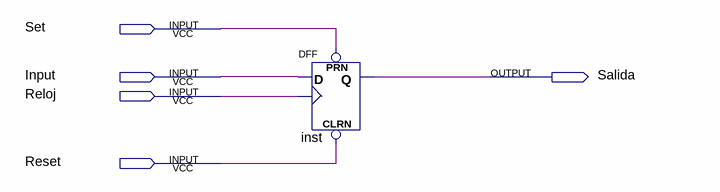
[diagram p0: schematic sheet]
// Quartus schematic FlipFlopD.bdf as structural Verilog: 1 symbols, 5 pins
module FlipFlopD (
  input  Set,
  input  Input,
  input  Reloj,
  input  Reset,
  output Salida
);

  DFF inst (.CLRN(Reset), .CLK(Reloj), .D(Input), .PRN(Set), .Q(Salida));
endmodule
